# Altium schematic sheet GSM.SchDoc
size A4; SheetNumber: 4; SheetTotal: 7
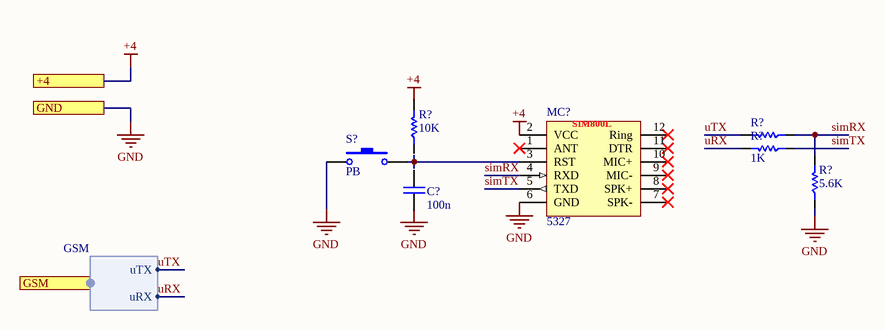
[diagram p0: GSM.SchDoc]

## Parts
(Parts that share a designator on the sheet are numbered #1, #2 ... from top to bottom, then left to right.)
C?  100n  [CAP 1206/3216]
MC?  Inflow: 5327  [Sim800L_Module]  (hidden comment: Sim800L)
R?#1  47K  [RES 1206 (3216X08L)]  (value not drawn)
R?#2  1K  [RES 1206 (3216X08L)]
R?#3  10K  [RES 1206 (3216X08L)]
R?#4  5.6K  [RES 1206 (3216X08L)]
S?  PB  [SW_PB_SMD_2PIN_SPST_6X3X2]

## Ports
+4, GND, GSM (harness GSM)

## Harnesses
GSM: uTX, uRX

## Nets
+4: MC?.2(VCC) ; port +4
GND: MC?.6(GND) R?#4.1 S?.2 ; port GND
simRX: MC?.4(RXD) R?#1.1 R?#4.2
simTX: MC?.5(TXD) R?#2.1
uRX: R?#2.2 ; port GSM.uRX
uTX: R?#1.2 ; port GSM.uTX
NetMC?_3: MC?.3(RST) S?.1

Not connected (* = marked no-connect by the designer): C? 1 2; MC? 1(ANT)* 7(SPK-)* 8(SPK+)* 9(MIC-)* 10(MIC+)* 11(DTR)* 12(Ring)*; R?#3 1 2

## Notes on the sheet
- Labels drawn without touching a wire or pin: +4, GND
- (in symbol ModSen_Com_Sim800L) SIM800L

## Library data of the parts
C? = Cap_Multi_SMD_100nF_1206: Bipolar ceramic capacitor SMD; Type: MultiLayer; Inflow: inflow?; Rating: 50V; Validation: Valid; Package: 1206; Value: 100n
MC? = ModSen_Com_Sim800L: SimCom GSM/GPRS Module; Rating: Rating?; Validation: NT; Value: Sim800L; Package: Dip; Type: GSM-GPRS
R?#1-R?#4 = Res_SMD_1206: Resistor; Inflow: inflow?; Rating: 0.25W; Validation: Valid; Package: 1206; Type: 10%
  R?#1: Value: 47K
  R?#2: Value: 1K
  R?#3: Value: 10K
  R?#4: Value: 5.6K
S? = SW_PushButton_2_SMD: SMT Tactile ‎Switch; Rating: 2b; Validation: Valid; Inflow: 8260; Type: Vertical; Package: SMD; Value: PB